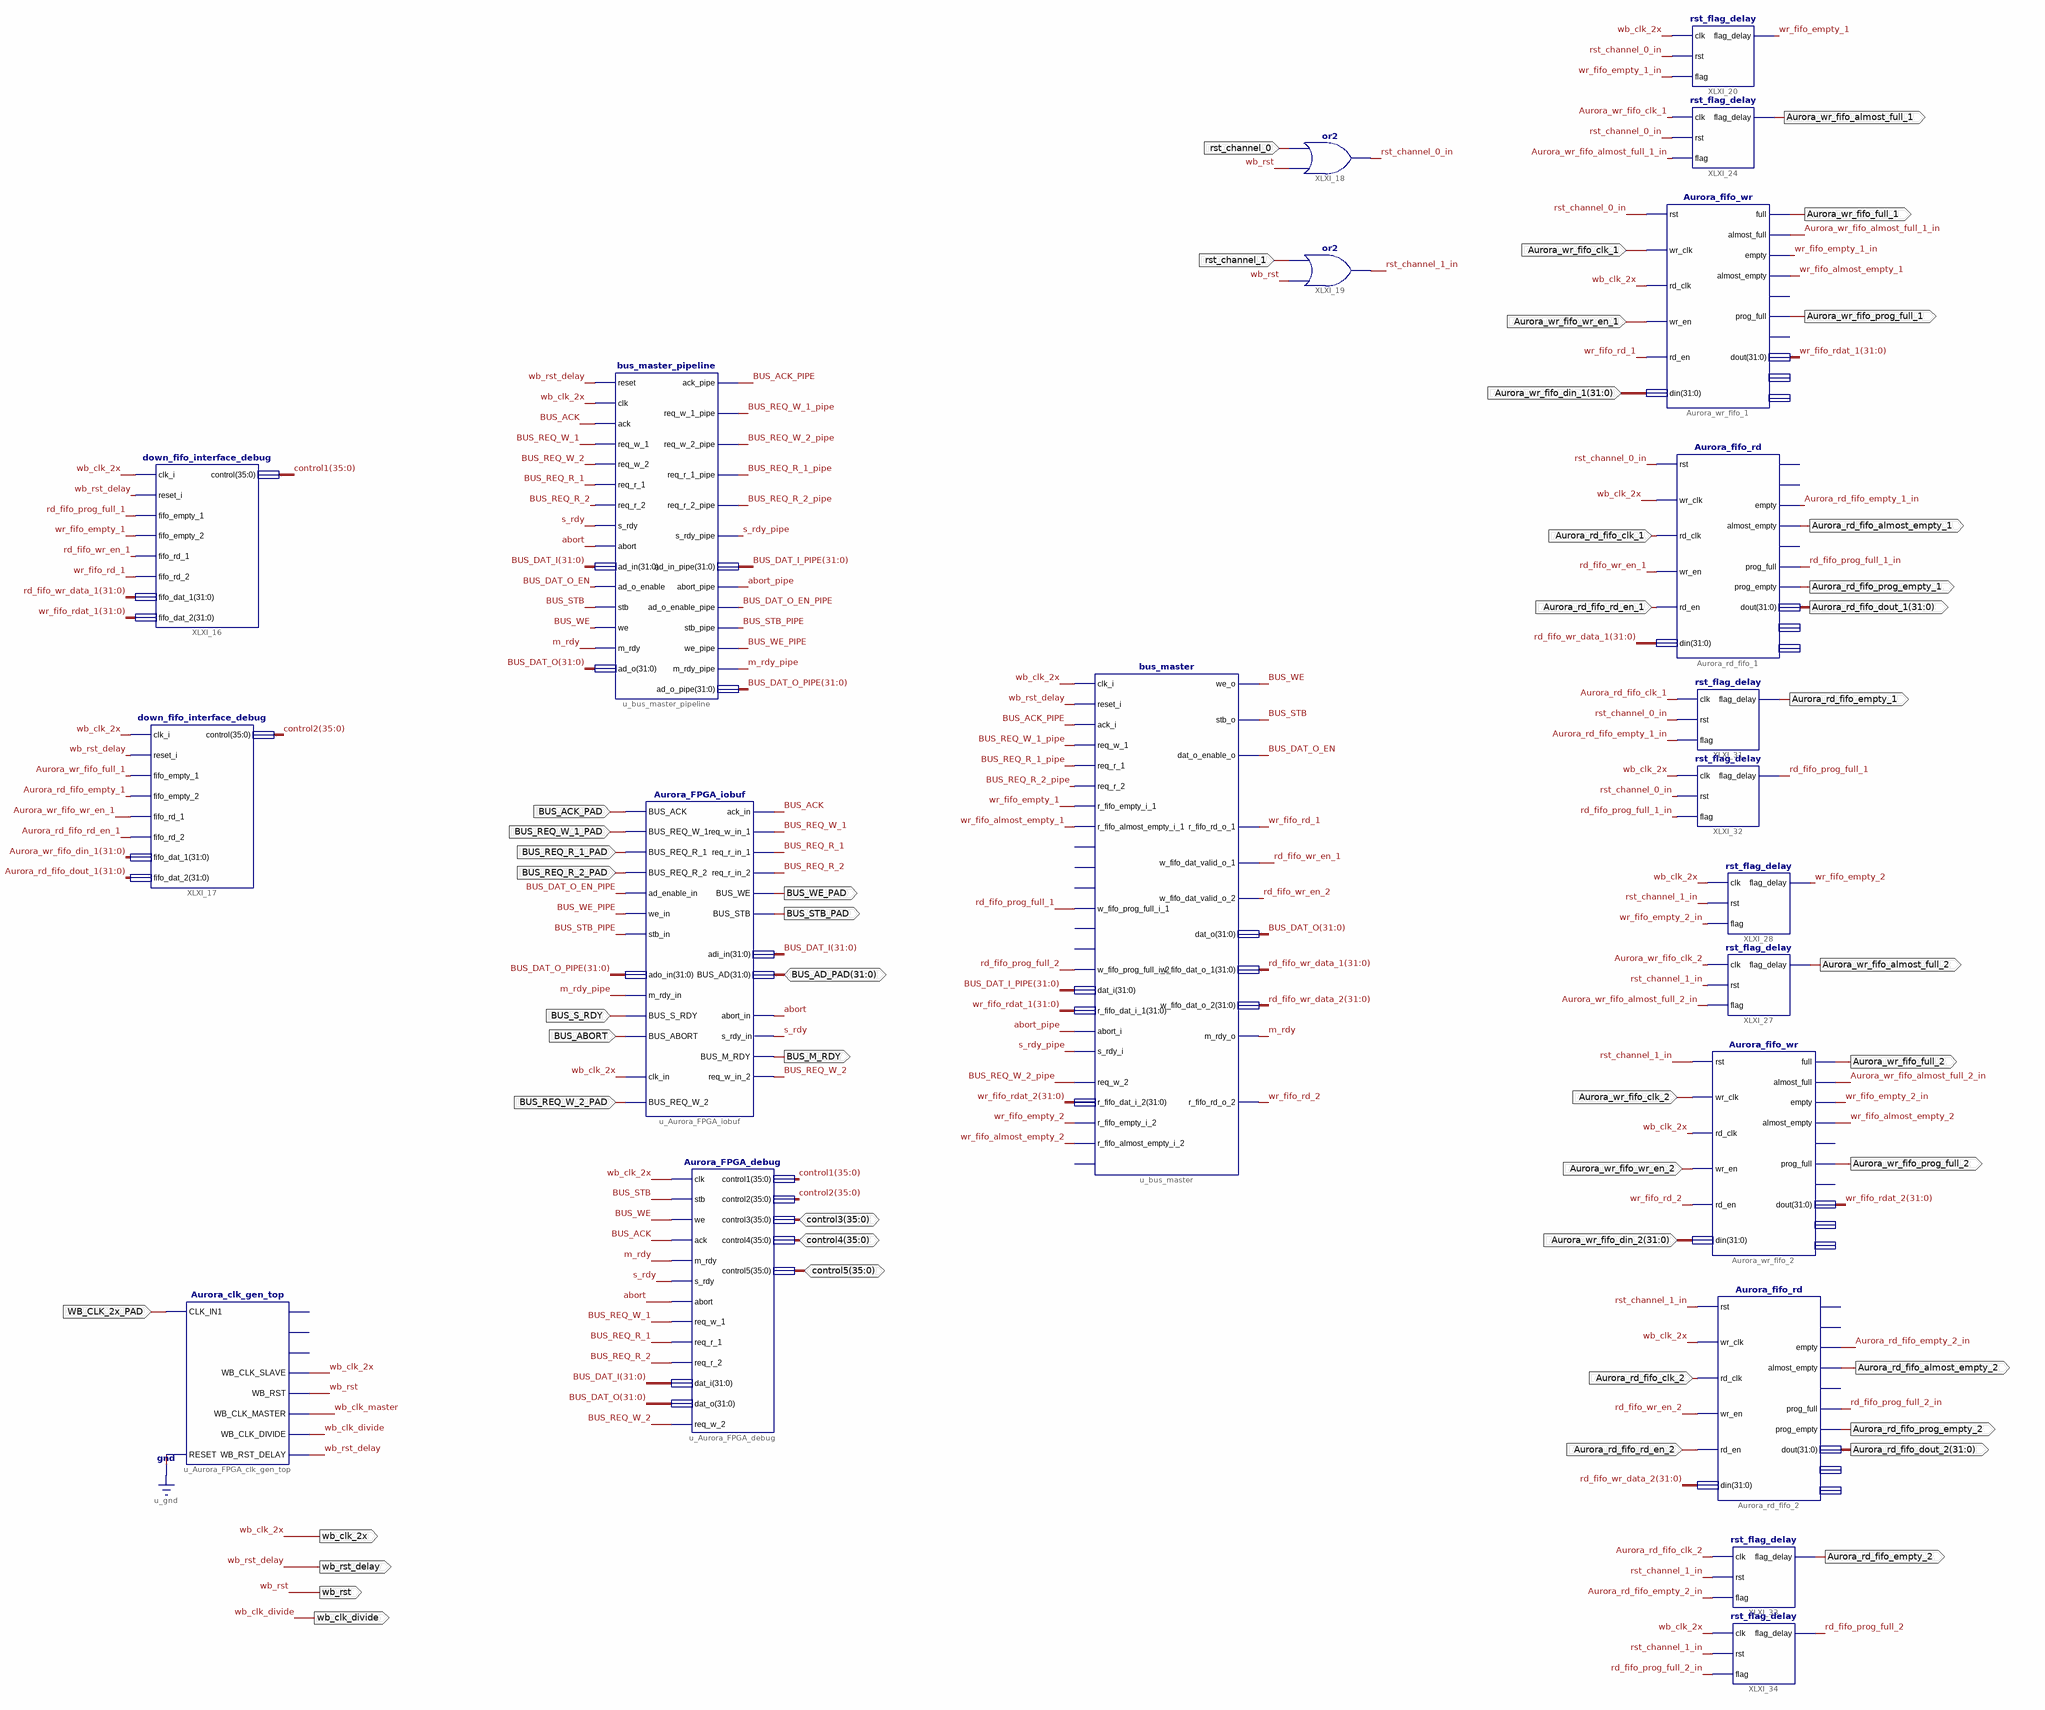
[diagram p0: schematic sheet 1]
// Xilinx ISE schematic Aurora_FPGA_BUS.sch (spartan6) as structural Verilog: 21 symbols, 45 ports
module Aurora_FPGA_BUS (
  input  Aurora_wr_fifo_clk_1,
  input  Aurora_wr_fifo_wr_en_1,
  input  Aurora_wr_fifo_clk_2,
  input  Aurora_wr_fifo_wr_en_2,
  input  Aurora_rd_fifo_clk_1,
  input  Aurora_rd_fifo_rd_en_1,
  input  Aurora_rd_fifo_clk_2,
  input  Aurora_rd_fifo_rd_en_2,
  input  BUS_ACK_PAD,
  input  BUS_REQ_W_1_PAD,
  input  BUS_REQ_R_1_PAD,
  input  BUS_REQ_R_2_PAD,
  input  BUS_S_RDY,
  input  BUS_ABORT,
  input  WB_CLK_2x_PAD,
  input  BUS_REQ_W_2_PAD,
  input  [31:0] Aurora_wr_fifo_din_1,
  input  [31:0] Aurora_wr_fifo_din_2,
  input  rst_channel_0,
  input  rst_channel_1,
  inout  [31:0] BUS_AD_PAD,
  inout  [35:0] control3,
  inout  [35:0] control4,
  inout  [35:0] control5,
  output wb_rst_delay,
  output wb_rst,
  output wb_clk_2x,
  output Aurora_wr_fifo_full_1,
  output Aurora_wr_fifo_almost_full_1,
  output Aurora_wr_fifo_prog_full_1,
  output Aurora_wr_fifo_full_2,
  output Aurora_wr_fifo_almost_full_2,
  output Aurora_wr_fifo_prog_full_2,
  output Aurora_rd_fifo_empty_1,
  output Aurora_rd_fifo_almost_empty_1,
  output Aurora_rd_fifo_prog_empty_1,
  output Aurora_rd_fifo_empty_2,
  output Aurora_rd_fifo_almost_empty_2,
  output Aurora_rd_fifo_prog_empty_2,
  output BUS_WE_PAD,
  output BUS_STB_PAD,
  output BUS_M_RDY,
  output [31:0] Aurora_rd_fifo_dout_1,
  output wb_clk_divide,
  output [31:0] Aurora_rd_fifo_dout_2
);

  wire abort, abort_pipe, Aurora_rd_fifo_empty_1_in, Aurora_rd_fifo_empty_2_in,
       Aurora_wr_fifo_almost_full_1_in, Aurora_wr_fifo_almost_full_2_in, BUS_ACK, BUS_ACK_PIPE, BUS_DAT_O_EN,
       BUS_DAT_O_EN_PIPE, BUS_REQ_R_1, BUS_REQ_R_1_pipe, BUS_REQ_R_2, BUS_REQ_R_2_pipe, BUS_REQ_W_1,
       BUS_REQ_W_1_pipe, BUS_REQ_W_2, BUS_REQ_W_2_pipe, BUS_STB, BUS_STB_PIPE, BUS_WE, BUS_WE_PIPE, m_rdy,
       m_rdy_pipe, rd_fifo_prog_full_1, rd_fifo_prog_full_1_in, rd_fifo_prog_full_2, rd_fifo_prog_full_2_in,
       rd_fifo_wr_en_1, rd_fifo_wr_en_2, rst_channel_0_in, rst_channel_1_in, s_rdy, s_rdy_pipe,
       wb_clk_master, wr_fifo_almost_empty_1, wr_fifo_almost_empty_2, wr_fifo_empty_1, wr_fifo_empty_1_in,
       wr_fifo_empty_2, wr_fifo_empty_2_in, wr_fifo_rd_1, wr_fifo_rd_2;
  wire [31:0] BUS_DAT_I, BUS_DAT_I_PIPE, BUS_DAT_O, BUS_DAT_O_PIPE, rd_fifo_wr_data_1, rd_fifo_wr_data_2,
       wr_fifo_rdat_1, wr_fifo_rdat_2;
  wire [35:0] control1, control2;

  Aurora_fifo_wr Aurora_wr_fifo_1 (
    .rst(rst_channel_0_in), .wr_clk(Aurora_wr_fifo_clk_1), .rd_clk(wb_clk_2x),
    .wr_en(Aurora_wr_fifo_wr_en_1), .rd_en(wr_fifo_rd_1), .din(Aurora_wr_fifo_din_1),
    .full(Aurora_wr_fifo_full_1), .almost_full(Aurora_wr_fifo_almost_full_1_in), .empty(wr_fifo_empty_1_in),
    .almost_empty(wr_fifo_almost_empty_1), .prog_full(Aurora_wr_fifo_prog_full_1), .dout(wr_fifo_rdat_1));  // open: valid, prog_empty, rd_data_count, wr_data_count
  Aurora_fifo_rd Aurora_rd_fifo_1 (
    .rst(rst_channel_0_in), .wr_clk(wb_clk_2x), .rd_clk(Aurora_rd_fifo_clk_1), .wr_en(rd_fifo_wr_en_1),
    .rd_en(Aurora_rd_fifo_rd_en_1), .din(rd_fifo_wr_data_1), .empty(Aurora_rd_fifo_empty_1_in),
    .almost_empty(Aurora_rd_fifo_almost_empty_1), .prog_full(rd_fifo_prog_full_1_in),
    .prog_empty(Aurora_rd_fifo_prog_empty_1), .dout(Aurora_rd_fifo_dout_1));  // open: full, almost_full, valid, rd_data_count, wr_data_count
  Aurora_fifo_wr Aurora_wr_fifo_2 (
    .rst(rst_channel_1_in), .wr_clk(Aurora_wr_fifo_clk_2), .rd_clk(wb_clk_2x),
    .wr_en(Aurora_wr_fifo_wr_en_2), .rd_en(wr_fifo_rd_2), .din(Aurora_wr_fifo_din_2),
    .full(Aurora_wr_fifo_full_2), .almost_full(Aurora_wr_fifo_almost_full_2_in), .empty(wr_fifo_empty_2_in),
    .almost_empty(wr_fifo_almost_empty_2), .prog_full(Aurora_wr_fifo_prog_full_2), .dout(wr_fifo_rdat_2));  // open: valid, prog_empty, rd_data_count, wr_data_count
  Aurora_fifo_rd Aurora_rd_fifo_2 (
    .rst(rst_channel_1_in), .wr_clk(wb_clk_2x), .rd_clk(Aurora_rd_fifo_clk_2), .wr_en(rd_fifo_wr_en_2),
    .rd_en(Aurora_rd_fifo_rd_en_2), .din(rd_fifo_wr_data_2), .empty(Aurora_rd_fifo_empty_2_in),
    .almost_empty(Aurora_rd_fifo_almost_empty_2), .prog_full(rd_fifo_prog_full_2_in),
    .prog_empty(Aurora_rd_fifo_prog_empty_2), .dout(Aurora_rd_fifo_dout_2));  // open: full, almost_full, valid, rd_data_count, wr_data_count
  bus_master u_bus_master (
    .clk_i(wb_clk_2x), .reset_i(wb_rst_delay), .ack_i(BUS_ACK_PIPE), .req_w_1(BUS_REQ_W_1_pipe),
    .req_r_1(BUS_REQ_R_1_pipe), .req_r_2(BUS_REQ_R_2_pipe), .r_fifo_empty_i_1(wr_fifo_empty_1),
    .r_fifo_almost_empty_i_1(wr_fifo_almost_empty_1), .w_fifo_prog_full_i_1(rd_fifo_prog_full_1),
    .w_fifo_prog_full_i_2(rd_fifo_prog_full_2), .dat_i(BUS_DAT_I_PIPE), .r_fifo_dat_i_1(wr_fifo_rdat_1),
    .we_o(BUS_WE), .stb_o(BUS_STB), .dat_o_enable_o(BUS_DAT_O_EN), .r_fifo_rd_o_1(wr_fifo_rd_1),
    .w_fifo_dat_valid_o_1(rd_fifo_wr_en_1), .w_fifo_dat_valid_o_2(rd_fifo_wr_en_2), .dat_o(BUS_DAT_O),
    .w_fifo_dat_o_1(rd_fifo_wr_data_1), .w_fifo_dat_o_2(rd_fifo_wr_data_2), .abort_i(abort_pipe),
    .s_rdy_i(s_rdy_pipe), .m_rdy_o(m_rdy), .r_fifo_dat_i_2(wr_fifo_rdat_2),
    .r_fifo_empty_i_2(wr_fifo_empty_2), .r_fifo_almost_empty_i_2(wr_fifo_almost_empty_2),
    .r_fifo_rd_o_2(wr_fifo_rd_2), .req_w_2(BUS_REQ_W_2_pipe));  // open: r_fifo_prog_empty_i_1, w_fifo_full_i_1, w_fifo_almost_full_i_1, w_fifo_full_i_2, w_fifo_almost_full_i_2, r_fifo_prog_empty_i_2
  Aurora_FPGA_iobuf u_Aurora_FPGA_iobuf (
    .BUS_ACK(BUS_ACK_PAD), .BUS_REQ_W_1(BUS_REQ_W_1_PAD), .BUS_REQ_R_1(BUS_REQ_R_1_PAD),
    .BUS_REQ_R_2(BUS_REQ_R_2_PAD), .ad_enable_in(BUS_DAT_O_EN_PIPE), .we_in(BUS_WE_PIPE),
    .stb_in(BUS_STB_PIPE), .ado_in(BUS_DAT_O_PIPE), .ack_in(BUS_ACK), .req_w_in_1(BUS_REQ_W_1),
    .req_r_in_1(BUS_REQ_R_1), .req_r_in_2(BUS_REQ_R_2), .BUS_WE(BUS_WE_PAD), .BUS_STB(BUS_STB_PAD),
    .adi_in(BUS_DAT_I), .BUS_AD(BUS_AD_PAD), .m_rdy_in(m_rdy_pipe), .BUS_S_RDY(BUS_S_RDY),
    .BUS_ABORT(BUS_ABORT), .abort_in(abort), .s_rdy_in(s_rdy), .BUS_M_RDY(BUS_M_RDY), .clk_in(wb_clk_2x),
    .BUS_REQ_W_2(BUS_REQ_W_2_PAD), .req_w_in_2(BUS_REQ_W_2));
  Aurora_FPGA_debug u_Aurora_FPGA_debug (
    .clk(wb_clk_2x), .stb(BUS_STB), .we(BUS_WE), .ack(BUS_ACK), .m_rdy(m_rdy), .s_rdy(s_rdy), .abort(abort),
    .req_w_1(BUS_REQ_W_1), .req_r_1(BUS_REQ_R_1), .req_r_2(BUS_REQ_R_2), .dat_i(BUS_DAT_I),
    .dat_o(BUS_DAT_O), .req_w_2(BUS_REQ_W_2), .control1(control1), .control2(control2), .control3(control3),
    .control4(control4), .control5(control5));
  Aurora_clk_gen_top u_Aurora_FPGA_clk_gen_top (
    .CLK_IN1(WB_CLK_2x_PAD), .RESET(1'b0), .WB_CLK_SLAVE(wb_clk_2x), .WB_RST(wb_rst),
    .WB_CLK_MASTER(wb_clk_master), .WB_CLK_DIVIDE(wb_clk_divide), .WB_RST_DELAY(wb_rst_delay));  // open: CLK_OUT1, CLK_OUT2, LOCKED
  bus_master_pipeline u_bus_master_pipeline (
    .reset(wb_rst_delay), .clk(wb_clk_2x), .ack(BUS_ACK), .req_w_1(BUS_REQ_W_1), .req_w_2(BUS_REQ_W_2),
    .req_r_1(BUS_REQ_R_1), .req_r_2(BUS_REQ_R_2), .s_rdy(s_rdy), .abort(abort), .ad_in(BUS_DAT_I),
    .ack_pipe(BUS_ACK_PIPE), .req_w_1_pipe(BUS_REQ_W_1_pipe), .req_w_2_pipe(BUS_REQ_W_2_pipe),
    .req_r_1_pipe(BUS_REQ_R_1_pipe), .req_r_2_pipe(BUS_REQ_R_2_pipe), .s_rdy_pipe(s_rdy_pipe),
    .ad_in_pipe(BUS_DAT_I_PIPE), .ad_o_enable(BUS_DAT_O_EN), .stb(BUS_STB), .we(BUS_WE), .m_rdy(m_rdy),
    .ad_o(BUS_DAT_O), .abort_pipe(abort_pipe), .ad_o_enable_pipe(BUS_DAT_O_EN_PIPE), .stb_pipe(BUS_STB_PIPE),
    .we_pipe(BUS_WE_PIPE), .m_rdy_pipe(m_rdy_pipe), .ad_o_pipe(BUS_DAT_O_PIPE));
  down_fifo_interface_debug XLXI_16 (
    .clk_i(wb_clk_2x), .reset_i(wb_rst_delay), .fifo_empty_1(rd_fifo_prog_full_1),
    .fifo_empty_2(wr_fifo_empty_1), .fifo_rd_1(rd_fifo_wr_en_1), .fifo_rd_2(wr_fifo_rd_1),
    .fifo_dat_1(rd_fifo_wr_data_1), .fifo_dat_2(wr_fifo_rdat_1), .control(control1));
  down_fifo_interface_debug XLXI_17 (
    .clk_i(wb_clk_2x), .reset_i(wb_rst_delay), .fifo_empty_1(Aurora_wr_fifo_full_1),
    .fifo_empty_2(Aurora_rd_fifo_empty_1), .fifo_rd_1(Aurora_wr_fifo_wr_en_1),
    .fifo_rd_2(Aurora_rd_fifo_rd_en_1), .fifo_dat_1(Aurora_wr_fifo_din_1),
    .fifo_dat_2(Aurora_rd_fifo_dout_1), .control(control2));
  or XLXI_18 (rst_channel_0_in, wb_rst, rst_channel_0);
  or XLXI_19 (rst_channel_1_in, wb_rst, rst_channel_1);
  rst_flag_delay XLXI_24 (
    .clk(Aurora_wr_fifo_clk_1), .rst(rst_channel_0_in), .flag(Aurora_wr_fifo_almost_full_1_in),
    .flag_delay(Aurora_wr_fifo_almost_full_1));
  rst_flag_delay XLXI_20 (
    .clk(wb_clk_2x), .rst(rst_channel_0_in), .flag(wr_fifo_empty_1_in), .flag_delay(wr_fifo_empty_1));
  rst_flag_delay XLXI_27 (
    .clk(Aurora_wr_fifo_clk_2), .rst(rst_channel_1_in), .flag(Aurora_wr_fifo_almost_full_2_in),
    .flag_delay(Aurora_wr_fifo_almost_full_2));
  rst_flag_delay XLXI_28 (
    .clk(wb_clk_2x), .rst(rst_channel_1_in), .flag(wr_fifo_empty_2_in), .flag_delay(wr_fifo_empty_2));
  rst_flag_delay XLXI_31 (
    .clk(Aurora_rd_fifo_clk_1), .rst(rst_channel_0_in), .flag(Aurora_rd_fifo_empty_1_in),
    .flag_delay(Aurora_rd_fifo_empty_1));
  rst_flag_delay XLXI_32 (
    .clk(wb_clk_2x), .rst(rst_channel_0_in), .flag(rd_fifo_prog_full_1_in), .flag_delay(rd_fifo_prog_full_1));
  rst_flag_delay XLXI_33 (
    .clk(Aurora_rd_fifo_clk_2), .rst(rst_channel_1_in), .flag(Aurora_rd_fifo_empty_2_in),
    .flag_delay(Aurora_rd_fifo_empty_2));
  rst_flag_delay XLXI_34 (
    .clk(wb_clk_2x), .rst(rst_channel_1_in), .flag(rd_fifo_prog_full_2_in), .flag_delay(rd_fifo_prog_full_2));
endmodule
